# Altium project COMECA-TestBoard.PrjPcb
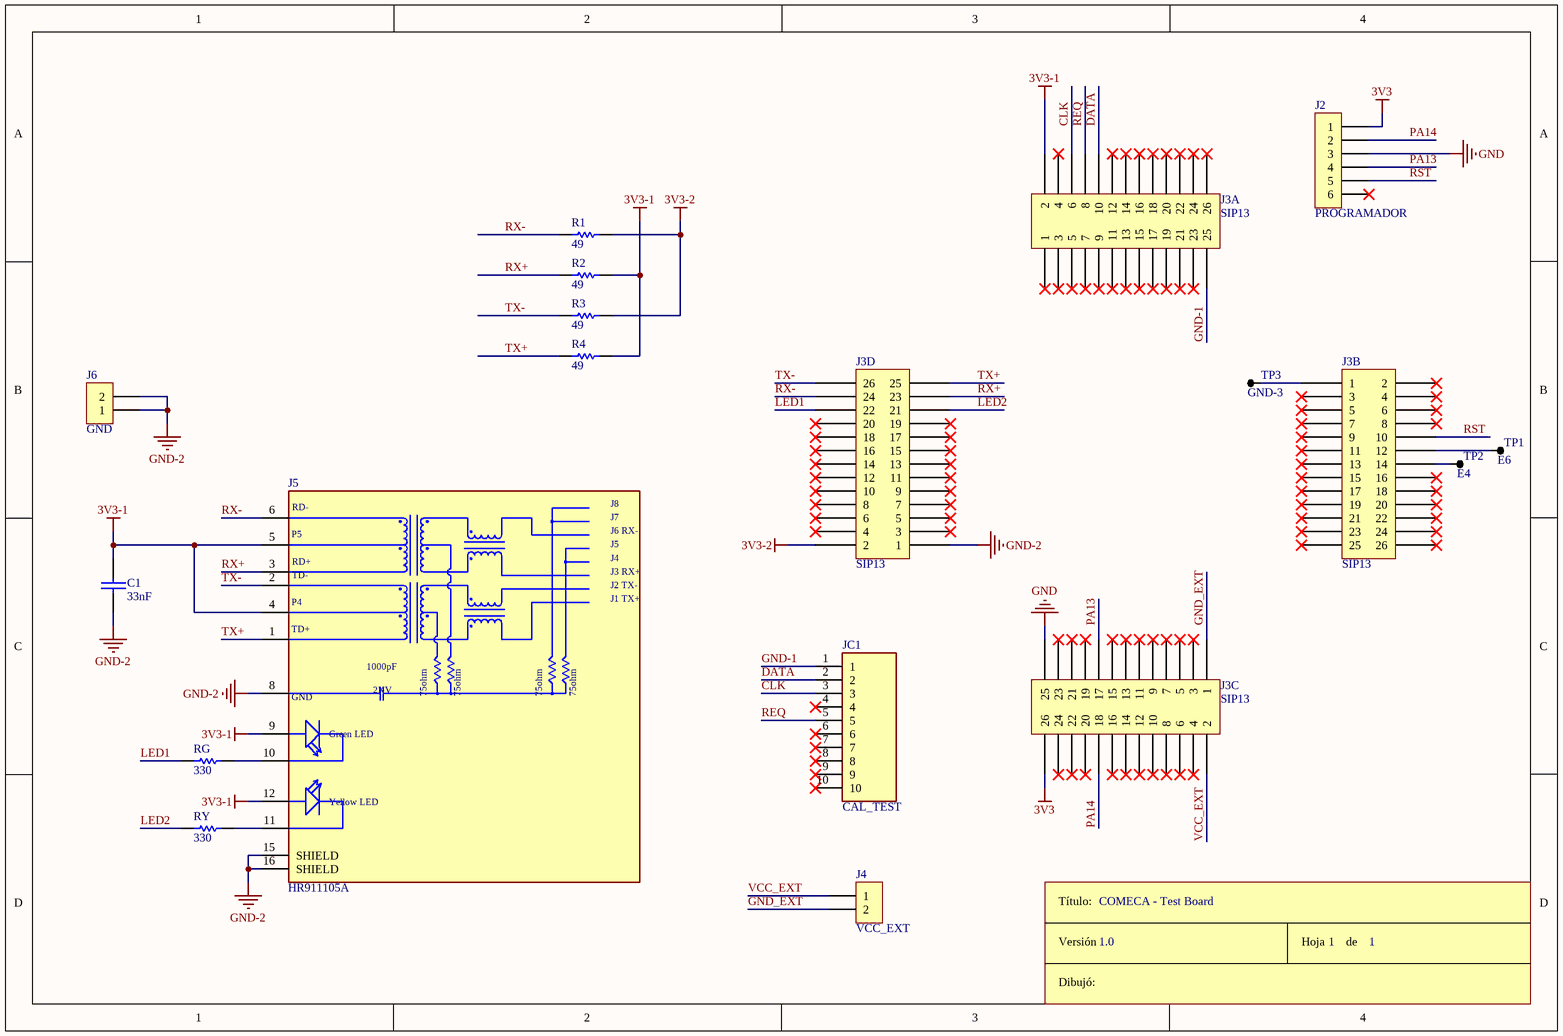
[diagram p0: COMECA_TestSCH.SchDoc]
1 sheet, 20 parts. Net scope: global (net labels, ports and power ports of the same name join across sheets).
Board file: COMECA-TestPCB.PcbDoc

## Sheet COMECA_TestSCH.SchDoc
size A4; SheetNumber: 1; SheetTotal: 1

### Parts
C1  33nF  [CAP100]
J2  PROGRAMADOR  [SIP6]
J3A  SIP13  [SIP13*2 - HDR]
J3B  SIP13  [SIP13*2 - HDR]
J3C  SIP13  [SIP13*2 - HDR]
J3D  SIP13  [SIP13*2 - HDR]
J4  VCC_EXT  [SIP2]
J5  HR911105A  [HANRUN_HR911105A]
J6  GND  [SIP2]
JC1  CAL_TEST  [TE_5104338-1 - 90DEG]
R1  49  [RES400]
R2  49  [RES400]
R3  49  [RES400]
R4  49  [RES400]
RG  330  [RES400]
ROT1  Rótulo  (value not drawn)  (graphical)
RY  330  [RES400]
TP1  E6  [TPTH]
TP2  E4  [TPTH]
TP3  GND-3  [TPTH]

### Nets
3V3: J2.1 J3C.26
3V3-1: C1.1 J3A.2 J5.4(P4) J5.5(P5) J5.9(GA) J5.12(YA) R2.2 R4.2
3V3-2: J3D.2 R1.2 R3.2
GND: J2.3 J3C.25
GND-2: C1.2 J3D.1 J5.8(GND) J5.15(SHIELD) J5.16(SHIELD) J6.1 J6.2
CLK: J3A.6 JC1.3
DATA: J3A.10 JC1.2
GND-1: J3A.25 JC1.1
GND_EXT: J3C.1 J4.2
LED1: J3D.22 RG.1
LED2: J3D.21 RY.1
PA13: J2.4 J3C.17
PA14: J2.2 J3C.18
REQ: J3A.8 JC1.5
RST: J2.5 J3B.10
RX+: J3D.23 J5.3(RD+) R2.1
RX-: J3D.24 J5.6(RD-) R1.1
TX+: J3D.25 J5.1(TD+) R4.1
TX-: J3D.26 J5.2(TD-) R3.1
VCC_EXT: J3C.2 J4.1
NetJ3B_1: J3B.1 TP3.1
NetJ3B_12: J3B.12 TP1.1
NetJ3B_14: J3B.14 TP2.1
NetJ5_10: J5.10(GC) RG.2
NetJ5_11: J5.11(YC) RY.2

Not connected (* = marked no-connect by the designer): J2 6*; J3A 1* 3* 4* 5* 7* 9* 11* 12* 13* 14* 15* 16* 17* 18* 19* 20* 21* 22* 23* 24* 26*; J3B 2* 3* 4* 5* 6* 7* 8* 9* 11* 13* 15* 16* 17* 18* 19* 20* 21* 22* 23* 24* 25* 26*; J3C 3* 4* 5* 6* 7* 8* 9* 10* 11* 12* 13* 14* 15* 16* 19* 20* 21* 22* 23* 24*; J3D 3* 4* 5* 6* 7* 8* 9* 10* 11* 12* 13* 14* 15* 16* 17* 18* 19* 20*; JC1 4* 6* 7* 8* 9* 10*

### Notes on the sheet
- COMECA - Test Board
- 1.0
- 1
- (in symbol HR911105A) J8; J7; J6 RX-; J4; J3 RX+; J2 TX-; J1 TX+; 1000pF; 2KV; 75ohm; Green LED; Yellow LED
- (in symbol Rótulo) Título:; Versión; Hoja       de; Dibujó:

### Library data of the parts
C1 = CAP
J2 = CON6
J3A J3B J3C J3D = CON13*2
J4 J6 = CON2
J5 = HR911105A: HR911105A Ethernet Interface Arduino Platform Evaluation Expansion Board; MF: DFRobot; Package: None; Availability: Unavailable; MP: HR911105A; Value: *; SnapEDA_Link: https://www.snapeda.com/parts/HR911105A/DFRobot/view-part/214807/?ref=snap; Price: None
JC1 = 5104338-1: HEADER; PIN; AMP-LATCH; 10 POS; 2.54 X 2.54; VERTICAL; LOW PROFILE; PCB; MF: TE Connectivity; Price: None; Value: *; MP: 5104338-1; Availability: Unavailable; SnapEDA_Link: https://www.snapeda.com/parts/5104338-1/TE%20Connectivity%20AMP%20Connectors/view-part/2881080/?ref=snap; TE_purchase_URL: https://www.te.com/usa-en/product-5104338-1.html?te_bu=Cor&te_type=disp&te_campaign=seda_glo_cor-seda-global-disp-prtnr-fy19-seda-model-bom-cta_sma-317_1&elqCampaignId=32493; Package: None
R1-R4 RG RY = RES
TP1-TP3 = TP